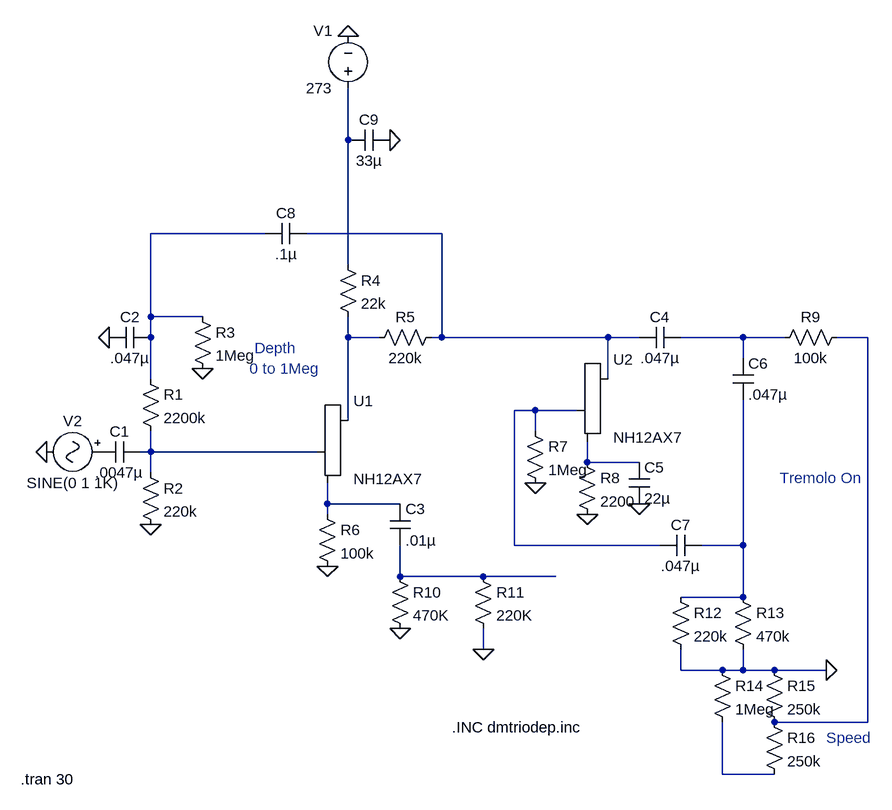
[diagram p0: schematic Matchless_Tremolo_midspeed_fulldepth.asc]
Matchless_Tremolo_midspeed_fulldepth.asc, the LTspice schematic file:
Version 4
SHEET 1 880 696
WIRE 48 -304 48 -384
WIRE -80 -160 -256 -160
WIRE 192 -160 -16 -160
WIRE 48 -112 48 -304
WIRE -256 -32 -256 -160
WIRE -176 -32 -256 -32
WIRE -256 0 -256 -32
WIRE 48 0 48 -32
WIRE 96 0 48 0
WIRE 192 0 192 -160
WIRE 192 0 176 0
WIRE 448 0 192 0
WIRE 496 0 448 0
WIRE 656 0 560 0
WIRE 720 0 656 0
WIRE 848 0 800 0
WIRE 656 32 656 0
WIRE -256 64 -256 0
WIRE 448 64 448 0
WIRE 336 112 304 112
WIRE 400 112 336 112
WIRE 48 128 48 0
WIRE 336 144 336 112
WIRE -256 176 -256 144
WIRE -256 176 -272 176
WIRE 0 176 -256 176
WIRE 416 192 416 160
WIRE 496 192 416 192
WIRE -256 208 -256 176
WIRE 16 256 16 224
WIRE 128 256 16 256
WIRE 16 272 16 256
WIRE 304 320 304 112
WIRE 528 320 304 320
WIRE 656 320 656 96
WIRE 656 320 592 320
WIRE 128 368 128 320
WIRE 256 368 128 368
WIRE 368 368 256 368
WIRE 656 400 656 320
WIRE 656 400 560 400
WIRE 256 480 256 448
WIRE 560 512 560 480
WIRE 624 512 560 512
WIRE 656 512 656 480
WIRE 656 512 624 512
WIRE 704 512 656 512
WIRE 784 512 704 512
WIRE 848 592 848 0
WIRE 848 592 704 592
WIRE 624 672 624 592
WIRE 704 672 624 672
FLAG 48 -464 0
FLAG -256 288 0
FLAG -320 0 0
FLAG -176 48 0
FLAG 16 352 0
FLAG 496 256 0
FLAG 416 272 0
FLAG 128 448 0
FLAG 256 480 0
FLAG 784 512 0
FLAG 336 224 0
FLAG -416 176 0
FLAG 112 -304 0
SYMBOL voltage 48 -368 R180
WINDOW 0 24 104 Left 0
WINDOW 3 24 16 Left 0
WINDOW 123 0 0 Left 0
WINDOW 39 0 0 Left 0
SYMATTR InstName V1
SYMATTR Value 273
SYMBOL cap -272 160 R90
WINDOW 0 0 32 VBottom 0
WINDOW 3 32 32 VTop 0
SYMATTR InstName C1
SYMATTR Value .0047µ
SYMBOL res -272 48 R0
SYMATTR InstName R1
SYMATTR Value 2200k
SYMBOL res -272 192 R0
SYMATTR InstName R2
SYMATTR Value 220k
SYMBOL cap -256 -16 R90
WINDOW 0 0 32 VBottom 0
WINDOW 3 32 32 VTop 0
SYMATTR InstName C2
SYMATTR Value .047µ
SYMBOL res -192 -48 R0
SYMATTR InstName R3
SYMATTR Value 1Meg
SYMBOL Misc\\triode 48 176 R0
SYMATTR InstName U1
SYMATTR Value NH12AX7
SYMBOL res 192 -16 R90
WINDOW 0 0 56 VBottom 0
WINDOW 3 32 56 VTop 0
SYMATTR InstName R5
SYMATTR Value 220k
SYMBOL res 0 256 R0
SYMATTR InstName R6
SYMATTR Value 100k
SYMBOL cap 112 256 R0
SYMATTR InstName C3
SYMATTR Value .01µ
SYMBOL Misc\\triode 448 112 R0
SYMATTR InstName U2
SYMATTR Value NH12AX7
SYMBOL res 320 128 R0
SYMATTR InstName R7
SYMATTR Value 1Meg
SYMBOL cap 560 -16 R90
WINDOW 0 0 32 VBottom 0
WINDOW 3 32 32 VTop 0
SYMATTR InstName C4
SYMATTR Value .047µ
SYMBOL cap 480 192 R0
SYMATTR InstName C5
SYMATTR Value 22µ
SYMBOL res 400 176 R0
SYMATTR InstName R8
SYMATTR Value 2200
SYMBOL cap 640 32 R0
SYMATTR InstName C6
SYMATTR Value .047µ
SYMBOL res 816 -16 R90
WINDOW 0 0 56 VBottom 0
WINDOW 3 32 56 VTop 0
SYMATTR InstName R9
SYMATTR Value 100k
SYMBOL cap 592 304 R90
WINDOW 0 0 32 VBottom 0
WINDOW 3 32 32 VTop 0
SYMATTR InstName C7
SYMATTR Value .047µ
SYMBOL res 112 352 R0
SYMATTR InstName R10
SYMATTR Value 470K
SYMBOL res 240 352 R0
SYMATTR InstName R11
SYMATTR Value 220K
SYMBOL res 544 384 R0
SYMATTR InstName R12
SYMATTR Value 220k
SYMBOL res 640 384 R0
SYMATTR InstName R13
SYMATTR Value 470k
SYMBOL res 608 496 R0
SYMATTR InstName R14
SYMATTR Value 1Meg
SYMBOL res 688 496 R0
SYMATTR InstName R15
SYMATTR Value 250k
SYMBOL res 688 576 R0
SYMATTR InstName R16
SYMATTR Value 250k
SYMBOL cap -16 -176 R90
WINDOW 0 0 32 VBottom 0
WINDOW 3 32 32 VTop 0
SYMATTR InstName C8
SYMATTR Value .1µ
SYMBOL res 32 -128 R0
SYMATTR InstName R4
SYMATTR Value 22k
SYMBOL cap 112 -320 R90
WINDOW 0 0 32 VBottom 0
WINDOW 3 32 32 VTop 0
SYMATTR InstName C9
SYMATTR Value 33µ
SYMBOL Misc\\signal -320 176 R90
WINDOW 0 -32 56 VBottom 0
WINDOW 3 32 56 VTop 0
SYMATTR InstName V2
TEXT -96 16 Left 0 ;Depth
TEXT 712 216 Left 0 ;Tremolo On
TEXT 784 616 Left 0 ;Speed
TEXT 208 600 Left 0 !.INC dmtriodep.inc
TEXT -456 680 Left 0 !.tran 30
TEXT -104 48 Left 0 ;0 to 1Meg

The netlist it stands for:
* Matchless_Tremolo_midspeed_fulldepth.asc
V1 N001 0 273
C1 N008 P001 .0047µ
R1 N002 N008 2200k
R2 N008 0 220k
C2 N002 0 .047µ
R3 N002 0 1Meg
XU1 N004 N008 N010 NH12AX7
R5 N003 N004 220k
R6 N010 0 100k
C3 N010 N012 .01µ
XU2 N003 N007 N009 NH12AX7
R7 N007 0 1Meg
C4 N005 N003 .047µ
C5 N009 0 22µ
R8 N009 0 2200
C6 N005 N011 .047µ
R9 N006 N005 100k
C7 N011 N007 .047µ
R10 N012 0 470K
R11 N012 0 220K
R12 N011 0 220k
R13 N011 0 470k
R14 0 N013 1Meg
R15 0 N006 250k
R16 N006 N013 250k
C8 N003 N002 .1µ
R4 N001 N004 22k
C9 0 N001 33µ
V2 P001 0 SINE(0 1 1K)
* Depth
* Tremolo On
* Speed
.INC dmtriodep.inc
.tran 30
* 0 to 1Meg
.backanno
.end